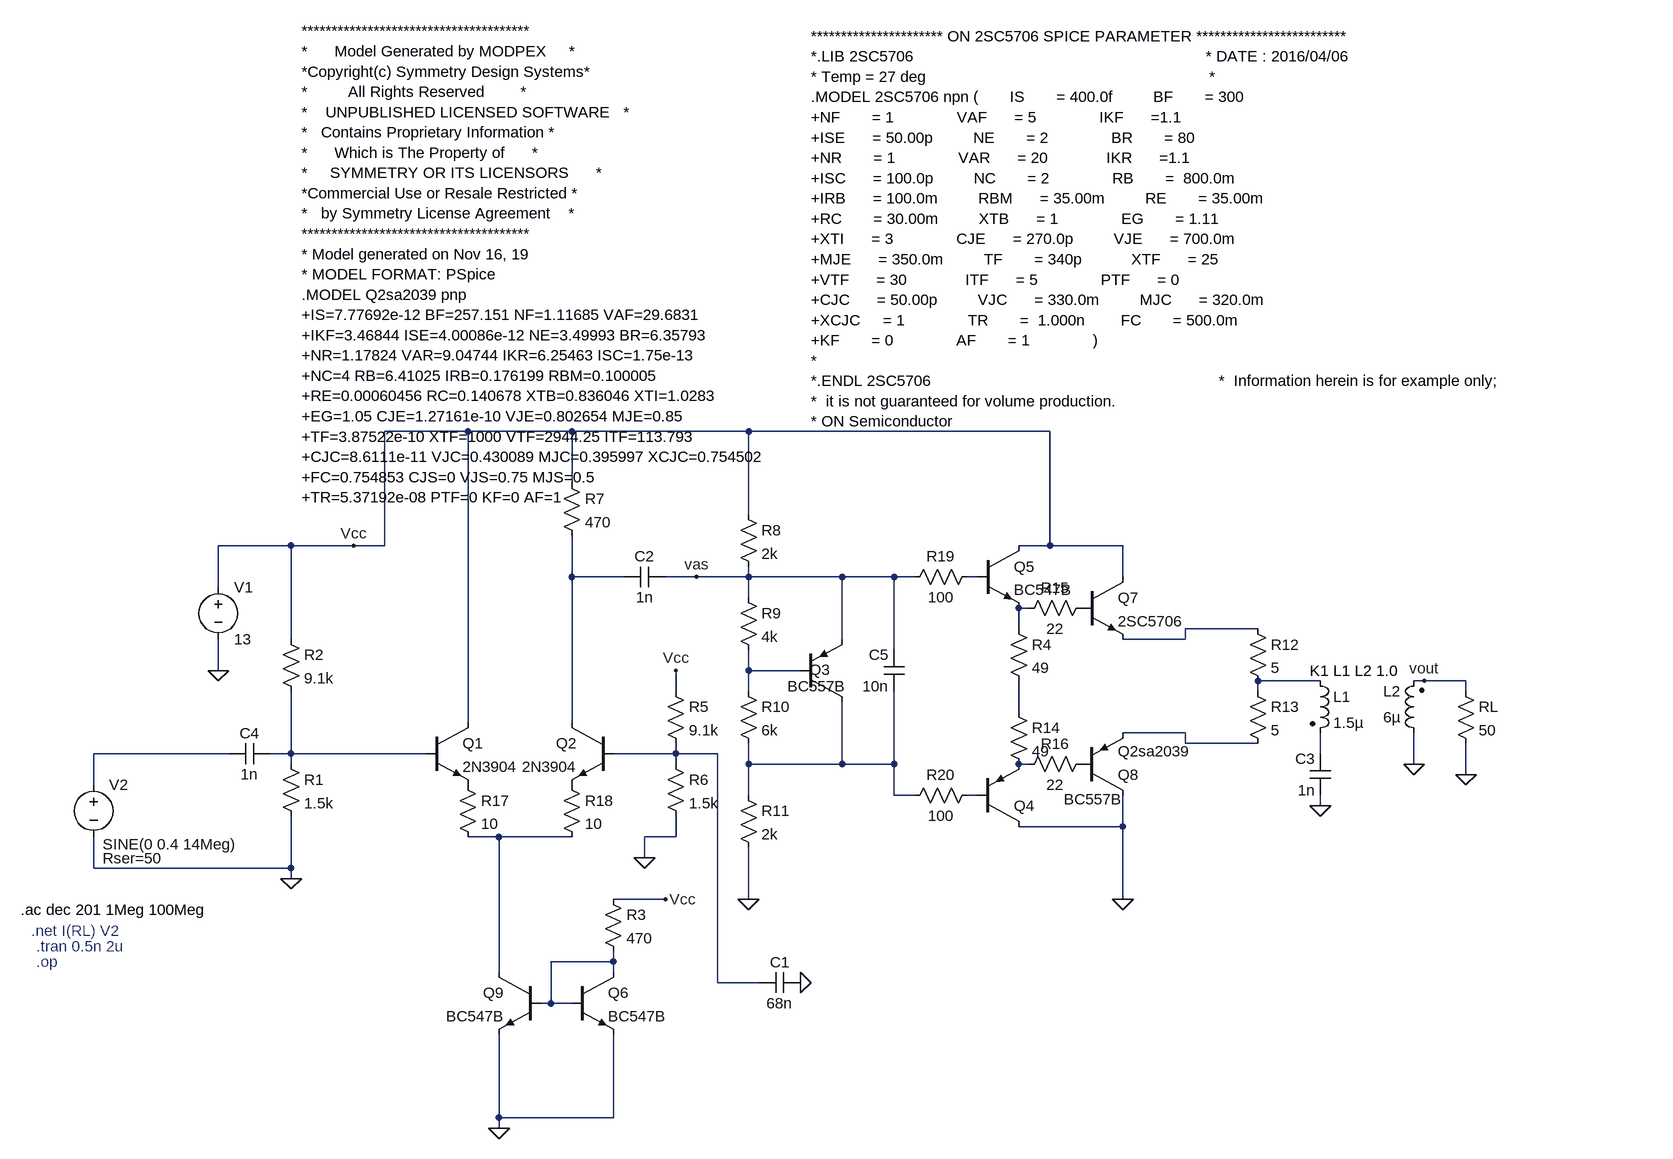
[diagram p0: schematic wideband_amp3.asc]
wideband_amp3.asc, the LTspice schematic file:
Version 4
SHEET 1 2008 1028
WIRE 128 -160 0 -160
WIRE 288 -160 128 -160
WIRE 560 -160 288 -160
WIRE 1024 -160 560 -160
WIRE 288 -80 288 -160
WIRE 560 -32 560 -160
WIRE -144 16 -256 16
WIRE -48 16 -144 16
WIRE 0 16 0 -160
WIRE 0 16 -48 16
WIRE 1024 16 1024 -160
WIRE 1024 16 976 16
WIRE 1136 16 1024 16
WIRE 288 64 288 0
WIRE 368 64 288 64
WIRE 480 64 432 64
WIRE 560 64 560 48
WIRE 560 64 480 64
WIRE 704 64 560 64
WIRE 784 64 704 64
WIRE 816 64 784 64
WIRE 912 64 896 64
WIRE 1136 64 1136 16
WIRE -256 80 -256 16
WIRE 560 96 560 64
WIRE 992 112 976 112
WIRE 976 144 976 112
WIRE 1344 144 1232 144
WIRE -144 160 -144 16
WIRE 704 160 704 64
WIRE 1232 160 1232 144
WIRE 1232 160 1136 160
WIRE 784 176 784 64
WIRE -256 208 -256 160
WIRE 560 208 560 176
WIRE 640 208 560 208
WIRE 1440 224 1344 224
WIRE 1600 224 1584 224
WIRE 1664 224 1600 224
WIRE 448 240 448 208
WIRE 560 240 560 208
WIRE 1344 240 1344 224
WIRE 1664 240 1664 224
WIRE 976 272 976 224
WIRE 128 288 128 -160
WIRE 288 288 288 64
WIRE 1232 304 1136 304
WIRE 1232 320 1232 304
WIRE 1344 320 1232 320
WIRE -240 336 -448 336
WIRE -144 336 -144 240
WIRE -144 336 -176 336
WIRE 64 336 -144 336
WIRE 448 336 448 320
WIRE 448 336 352 336
WIRE 512 336 448 336
WIRE 1440 336 1440 304
WIRE -144 352 -144 336
WIRE 448 352 448 336
WIRE 560 352 560 320
WIRE 704 352 704 256
WIRE 704 352 560 352
WIRE 784 352 784 240
WIRE 784 352 704 352
WIRE 992 352 976 352
WIRE 1584 352 1584 304
WIRE 1664 368 1664 320
WIRE -448 384 -448 336
WIRE 560 400 560 352
WIRE 784 400 784 352
WIRE 816 400 784 400
WIRE 912 400 896 400
WIRE 1440 416 1440 400
WIRE 1136 448 1136 400
WIRE 1136 448 976 448
WIRE 176 464 128 464
WIRE 288 464 176 464
WIRE 448 464 448 432
WIRE 448 464 400 464
WIRE 400 496 400 464
WIRE -448 512 -448 464
WIRE -144 512 -144 432
WIRE -144 512 -448 512
WIRE -144 528 -144 512
WIRE 432 560 352 560
WIRE 560 560 560 480
WIRE 1136 560 1136 448
WIRE 352 656 352 640
WIRE 352 656 256 656
WIRE 176 672 176 464
WIRE 352 672 352 656
WIRE 512 688 512 336
WIRE 576 688 512 688
WIRE 256 720 256 656
WIRE 256 720 240 720
WIRE 288 720 256 720
WIRE 176 896 176 768
WIRE 352 896 352 768
WIRE 352 896 176 896
WIRE 176 912 176 896
FLAG 1664 368 0
FLAG -144 528 0
FLAG -256 208 0
FLAG 480 64 vas
FLAG 560 560 0
FLAG 1600 224 vout
FLAG -48 16 Vcc
FLAG 432 560 Vcc
FLAG 176 912 0
FLAG 400 496 0
FLAG 448 208 Vcc
FLAG 1136 560 0
FLAG 640 688 0
FLAG 1440 416 0
FLAG 1584 352 0
DATAFLAG -64 336 "$"
DATAFLAG 1040 16 ""
DATAFLAG 688 64 ""
DATAFLAG 624 352 ""
DATAFLAG 1280 144 ""
DATAFLAG 208 464 "$"
DATAFLAG 352 64 "$"
DATAFLAG 1392 224 ""
SYMBOL npn3 64 288 R0
SYMATTR InstName Q1
SYMATTR Value 2N3904
SYMBOL npn3 352 288 M0
SYMATTR InstName Q2
SYMATTR Value 2N3904
SYMBOL res -160 336 R0
SYMATTR InstName R1
SYMATTR Value 1.5k
SYMBOL res -160 144 R0
SYMATTR InstName R2
SYMATTR Value 9.1k
SYMBOL res 272 -96 R0
SYMATTR InstName R7
SYMATTR Value 470
SYMBOL res 1648 224 R0
SYMATTR InstName RL
SYMATTR Value 50
SYMBOL voltage -256 64 R0
SYMATTR InstName V1
SYMATTR Value 13
SYMBOL voltage -448 368 R0
WINDOW 3 14 107 Left 2
WINDOW 39 14 129 Left 2
SYMATTR Value SINE(0 0.4 14Meg)
SYMATTR SpiceLine Rser=50
SYMATTR InstName V2
SYMATTR Value2 AC 1
SYMBOL cap 432 48 R90
WINDOW 0 0 32 VBottom 2
WINDOW 3 32 32 VTop 2
SYMATTR InstName C2
SYMATTR Value 1n
SYMBOL cap -240 352 R270
WINDOW 0 32 32 VTop 2
WINDOW 3 0 32 VBottom 2
SYMATTR InstName C4
SYMATTR Value 1n
SYMBOL pnp 640 256 M180
WINDOW 0 14 49 Left 2
WINDOW 3 -20 24 Left 2
SYMATTR InstName Q3
SYMATTR Value BC557B
SYMBOL res 544 -48 R0
SYMATTR InstName R8
SYMATTR Value 2k
SYMBOL res 544 80 R0
SYMATTR InstName R9
SYMATTR Value 4k
SYMBOL res 544 224 R0
SYMATTR InstName R10
SYMATTR Value 6k
SYMBOL res 544 384 R0
SYMATTR InstName R11
SYMATTR Value 2k
SYMBOL pnp 912 448 M180
WINDOW 3 133 42 Left 2
SYMATTR Value BC557B
SYMATTR InstName Q4
SYMBOL npn 912 16 R0
SYMATTR InstName Q5
SYMATTR Value BC547B
SYMBOL res 1328 128 R0
SYMATTR InstName R12
SYMATTR Value 5
SYMBOL res 1328 224 R0
SYMATTR InstName R13
SYMATTR Value 5
SYMBOL cap 800 240 R180
WINDOW 0 24 56 Left 2
WINDOW 3 24 8 Left 2
SYMATTR InstName C5
SYMATTR Value 10n
SYMBOL npn 1072 64 R0
SYMATTR InstName Q7
SYMATTR Value 2SC5706
SYMBOL pnp 1072 400 M180
SYMATTR InstName Q8
SYMATTR Value Q2sa2039
SYMBOL npn 288 672 R0
SYMATTR InstName Q6
SYMATTR Value BC547B
SYMBOL res 336 544 R0
SYMATTR InstName R3
SYMATTR Value 470
SYMBOL cap 576 704 R270
WINDOW 0 32 32 VTop 2
WINDOW 3 0 32 VBottom 2
SYMATTR InstName C1
SYMATTR Value 68n
SYMBOL res 432 224 R0
SYMATTR InstName R5
SYMATTR Value 9.1k
SYMBOL res 432 336 R0
SYMATTR InstName R6
SYMATTR Value 1.5k
SYMBOL npn 240 672 M0
SYMATTR InstName Q9
SYMATTR Value BC547B
SYMBOL res 960 128 R0
SYMATTR InstName R4
SYMATTR Value 49
SYMBOL res 960 256 R0
SYMATTR InstName R14
SYMATTR Value 49
SYMBOL res 1088 96 R90
WINDOW 0 0 56 VBottom 2
WINDOW 3 32 56 VTop 2
SYMATTR InstName R15
SYMATTR Value 22
SYMBOL res 1088 336 R90
WINDOW 0 0 56 VBottom 2
WINDOW 3 32 56 VTop 2
SYMATTR InstName R16
SYMATTR Value 22
SYMBOL res 112 368 R0
SYMATTR InstName R17
SYMATTR Value 10
SYMBOL res 272 368 R0
SYMATTR InstName R18
SYMATTR Value 10
SYMBOL res 912 48 R90
WINDOW 0 0 56 VBottom 2
WINDOW 3 32 56 VTop 2
SYMATTR InstName R19
SYMATTR Value 100
SYMBOL res 912 384 R90
WINDOW 0 0 56 VBottom 2
WINDOW 3 32 56 VTop 2
SYMATTR InstName R20
SYMATTR Value 100
SYMBOL cap 1456 400 R180
WINDOW 0 24 56 Left 2
WINDOW 3 24 8 Left 2
SYMATTR InstName C3
SYMATTR Value 1n
SYMBOL ind2 1424 208 R0
SYMATTR InstName L1
SYMATTR Value 1.5µ
SYMATTR Type ind
SYMBOL ind2 1600 320 R180
WINDOW 0 36 80 Left 2
WINDOW 3 36 40 Left 2
SYMATTR InstName L2
SYMATTR Value 6µ
SYMATTR Type ind
TEXT -560 576 Left 2 !.ac dec 201 1Meg 100Meg
TEXT -536 632 Left 2 ;.tran 0.5n 2u
TEXT -544 608 Left 2 ;.net I(RL) V2
TEXT -536 656 Left 2 ;.op
TEXT -128 -776 Left 2 !**************************************\n*      Model Generated by MODPEX     *\n*Copyright(c) Symmetry Design Systems*\n*         All Rights Reserved        *\n*    UNPUBLISHED LICENSED SOFTWARE   *\n*   Contains Proprietary Information *\n*      Which is The Property of      *\n*     SYMMETRY OR ITS LICENSORS      *\n*Commercial Use or Resale Restricted *\n*   by Symmetry License Agreement    *\n**************************************\n* Model generated on Nov 16, 19\n* MODEL FORMAT: PSpice\n.MODEL Q2sa2039 pnp\n+IS=7.77692e-12 BF=257.151 NF=1.11685 VAF=29.6831\n+IKF=3.46844 ISE=4.00086e-12 NE=3.49993 BR=6.35793\n+NR=1.17824 VAR=9.04744 IKR=6.25463 ISC=1.75e-13\n+NC=4 RB=6.41025 IRB=0.176199 RBM=0.100005\n+RE=0.00060456 RC=0.140678 XTB=0.836046 XTI=1.0283\n+EG=1.05 CJE=1.27161e-10 VJE=0.802654 MJE=0.85\n+TF=3.87522e-10 XTF=1000 VTF=2944.25 ITF=113.793\n+CJC=8.6111e-11 VJC=0.430089 MJC=0.395997 XCJC=0.754502\n+FC=0.754853 CJS=0 VJS=0.75 MJS=0.5\n+TR=5.37192e-08 PTF=0 KF=0 AF=1
TEXT 656 -768 Left 2 !********************** ON 2SC5706 SPICE PARAMETER *************************\n*.LIB 2SC5706                                                                 * DATE : 2016/04/06                                                           \n* Temp = 27 deg                                                               *                                                                             \n.MODEL 2SC5706 npn (       IS       = 400.0f         BF       = 300           \n+NF       = 1              VAF      = 5              IKF      =1.1            \n+ISE      = 50.00p         NE       = 2              BR       = 80            \n+NR       = 1              VAR      = 20             IKR      =1.1            \n+ISC      = 100.0p         NC       = 2              RB       =  800.0m       \n+IRB      = 100.0m         RBM      = 35.00m         RE       = 35.00m        \n+RC       = 30.00m         XTB      = 1              EG       = 1.11          \n+XTI      = 3              CJE      = 270.0p         VJE      = 700.0m        \n+MJE      = 350.0m         TF       = 340p           XTF      = 25            \n+VTF      = 30             ITF      = 5              PTF      = 0             \n+CJC      = 50.00p         VJC      = 330.0m         MJC      = 320.0m        \n+XCJC     = 1              TR       =  1.000n        FC       = 500.0m        \n+KF       = 0              AF       = 1              )                        \n*                                                                             \n*.ENDL 2SC5706                                                                *  Information herein is for example only;                                    \n*  it is not guaranteed for volume production.                                \n* ON Semiconductor
TEXT 1424 208 Left 2 !K1 L1 L2 1.0

The netlist it stands for:
* wideband_amp3.asc
Q1 Vcc N010 P001 0 2N3904
Q2 N001 N011 P002 0 2N3904
R1 N010 0 1.5k
R2 Vcc N010 9.1k
R7 Vcc N001 470
RL vout 0 50
V1 Vcc 0 13
V2 N009 0 SINE(0 0.4 14Meg) AC 1 Rser=50
C2 vas N001 1n
C4 N009 N010 1n
Q3 N013 N005 vas 0 BC557B
R8 Vcc vas 2k
R9 vas N005 4k
R10 N005 N013 6k
R11 N013 0 2k
Q4 0 N015 N014 0 BC557B
Q5 Vcc N002 N003 0 BC547B
R12 N004 N006 5
R13 N006 N008 5
C5 N013 vas 10n
Q7 Vcc P003 N004 0 2SC5706
Q8 0 P004 N008 0 Q2sa2039
Q6 N017 N017 0 0 BC547B
R3 Vcc N017 470
C1 N011 0 68n
R5 Vcc N011 9.1k
R6 N011 0 1.5k
Q9 N016 N017 0 0 BC547B
R4 N003 N007 49
R14 N007 N014 49
R15 P003 N003 22
R16 P004 N014 22
R17 P001 N016 10
R18 P002 N016 10
R19 N002 vas 100
R20 N015 N013 100
C3 0 N012 1n
L1 N006 N012 1.5µ
L2 0 vout 6µ
.model NPN NPN
.model PNP PNP
.lib standard.bjt
.ac dec 201 1Meg 100Meg
* .tran 0.5n 2u
* .net I(RL) V2
* .op
**************************************
*      Model Generated by MODPEX     *
*Copyright(c) Symmetry Design Systems*
*         All Rights Reserved        *
*    UNPUBLISHED LICENSED SOFTWARE   *
*   Contains Proprietary Information *
*      Which is The Property of      *
*     SYMMETRY OR ITS LICENSORS      *
*Commercial Use or Resale Restricted *
*   by Symmetry License Agreement    *
**************************************
* Model generated on Nov 16, 19
* MODEL FORMAT: PSpice
.MODEL Q2sa2039 pnp
+IS=7.77692e-12 BF=257.151 NF=1.11685 VAF=29.6831
+IKF=3.46844 ISE=4.00086e-12 NE=3.49993 BR=6.35793
+NR=1.17824 VAR=9.04744 IKR=6.25463 ISC=1.75e-13
+NC=4 RB=6.41025 IRB=0.176199 RBM=0.100005
+RE=0.00060456 RC=0.140678 XTB=0.836046 XTI=1.0283
+EG=1.05 CJE=1.27161e-10 VJE=0.802654 MJE=0.85
+TF=3.87522e-10 XTF=1000 VTF=2944.25 ITF=113.793
+CJC=8.6111e-11 VJC=0.430089 MJC=0.395997 XCJC=0.754502
+FC=0.754853 CJS=0 VJS=0.75 MJS=0.5
+TR=5.37192e-08 PTF=0 KF=0 AF=1
********************** ON 2SC5706 SPICE PARAMETER *************************
*.LIB 2SC5706                                                                 * DATE : 2016/04/06
* Temp = 27 deg                                                               *
.MODEL 2SC5706 npn (       IS       = 400.0f         BF       = 300
+NF       = 1              VAF      = 5              IKF      =1.1
+ISE      = 50.00p         NE       = 2              BR       = 80
+NR       = 1              VAR      = 20             IKR      =1.1
+ISC      = 100.0p         NC       = 2              RB       =  800.0m
+IRB      = 100.0m         RBM      = 35.00m         RE       = 35.00m
+RC       = 30.00m         XTB      = 1              EG       = 1.11
+XTI      = 3              CJE      = 270.0p         VJE      = 700.0m
+MJE      = 350.0m         TF       = 340p           XTF      = 25
+VTF      = 30             ITF      = 5              PTF      = 0
+CJC      = 50.00p         VJC      = 330.0m         MJC      = 320.0m
+XCJC     = 1              TR       =  1.000n        FC       = 500.0m
+KF       = 0              AF       = 1              )
*
*.ENDL 2SC5706                                                                *  Information herein is for example only;
*  it is not guaranteed for volume production.
* ON Semiconductor
K1 L1 L2 1.0
.backanno
.end